# Altium schematic sheet DAC8551IADGKRDAC8551IADGKR.schdoc
size 127 x 101 mm
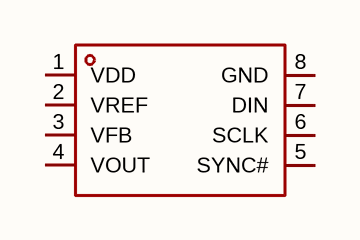
[diagram p0: DAC8551IADGKRDAC8551IADGKR.schdoc]

## Parts
U?  (no value)

## Nets

Not connected (* = marked no-connect by the designer): U? 1(VDD) 2(VREF) 3(VFB) 4(VOUT) 5(SYNC#) 6(SCLK) 7(DIN) 8(GND)

## Library data of the parts
U? = DAC8551IADGKR: Symbol: DAC8551IADGKR